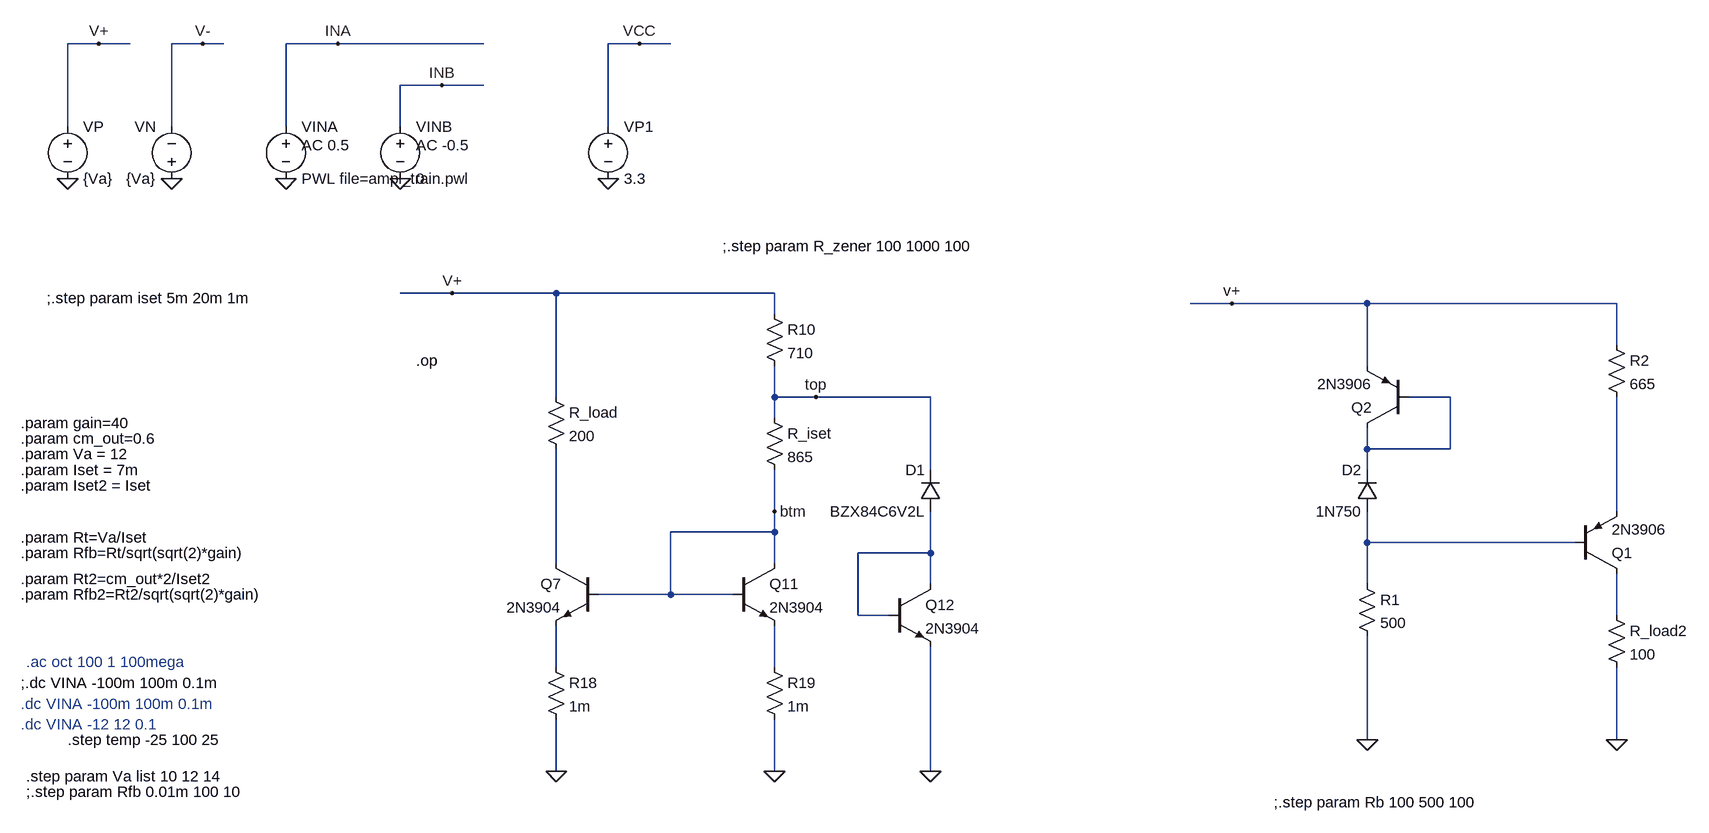
[diagram p0: schematic current_source_learning1.asc]
current_source_learning1.asc, the LTspice schematic file:
Version 4.1
SHEET 1 4868 1780
WIRE -16 -768 -64 -768
WIRE 32 -768 -16 -768
WIRE 144 -768 96 -768
WIRE 176 -768 144 -768
WIRE 352 -768 272 -768
WIRE 576 -768 352 -768
WIRE 816 -768 768 -768
WIRE 864 -768 816 -768
WIRE 512 -704 448 -704
WIRE 576 -704 512 -704
WIRE -64 -640 -64 -768
WIRE 96 -640 96 -768
WIRE 272 -640 272 -768
WIRE 448 -640 448 -704
WIRE 768 -640 768 -768
WIRE 528 -384 448 -384
WIRE 688 -384 528 -384
WIRE 1024 -384 688 -384
WIRE 1728 -368 1664 -368
WIRE 1936 -368 1728 -368
WIRE 2320 -368 1936 -368
WIRE 1024 -352 1024 -384
WIRE 2320 -304 2320 -368
WIRE 1936 -272 1936 -368
WIRE 688 -224 688 -384
WIRE 1024 -224 1024 -272
WIRE 1088 -224 1024 -224
WIRE 1264 -224 1088 -224
WIRE 2064 -224 2000 -224
WIRE 1024 -192 1024 -224
WIRE 1936 -144 1936 -176
WIRE 2064 -144 2064 -224
WIRE 2064 -144 1936 -144
WIRE 1264 -112 1264 -224
WIRE 1936 -112 1936 -144
WIRE 1024 -48 1024 -112
WIRE 2320 -48 2320 -224
WIRE 1024 -16 1024 -48
WIRE 1024 -16 864 -16
WIRE 1936 0 1936 -48
WIRE 2256 0 1936 0
WIRE 1264 16 1264 -48
WIRE 1264 16 1152 16
WIRE 688 32 688 -144
WIRE 1024 32 1024 -16
WIRE 1264 64 1264 16
WIRE 1936 64 1936 0
WIRE 864 80 864 -16
WIRE 864 80 752 80
WIRE 960 80 864 80
WIRE 1152 112 1152 16
WIRE 1200 112 1152 112
WIRE 2320 112 2320 48
WIRE 688 192 688 128
WIRE 1024 192 1024 128
WIRE 1936 304 1936 144
WIRE 2320 304 2320 192
WIRE 688 352 688 272
WIRE 1024 352 1024 272
WIRE 1264 352 1264 160
FLAG -64 -560 0
FLAG 272 -560 0
FLAG 96 -560 0
FLAG 448 -560 0
FLAG -16 -768 V+
FLAG 144 -768 V-
FLAG 352 -768 INA
FLAG 512 -704 INB
FLAG 768 -560 0
FLAG 816 -768 VCC
FLAG 688 352 0
FLAG 1024 352 0
FLAG 528 -384 V+
FLAG 1264 352 0
FLAG 1088 -224 top
FLAG 1024 -48 btm
FLAG 1936 304 0
FLAG 1728 -368 v+
FLAG 2320 304 0
SYMBOL voltage -64 -656 R0
SYMATTR InstName VP
SYMATTR Value {Va}
SYMBOL voltage 96 -544 R180
WINDOW 0 24 96 Left 2
WINDOW 3 24 16 Left 2
SYMATTR InstName VN
SYMATTR Value {Va}
SYMBOL voltage 272 -656 R0
WINDOW 123 24 44 Left 2
WINDOW 39 0 0 Left 0
SYMATTR Value2 AC 0.5
SYMATTR InstName VINA
SYMATTR Value PWL file=ampl_train.pwl
SYMBOL voltage 448 -656 R0
WINDOW 123 24 44 Left 2
WINDOW 39 0 0 Left 0
SYMATTR Value2 AC -0.5
SYMATTR InstName VINB
SYMATTR Value 0
SYMBOL voltage 768 -656 R0
SYMATTR InstName VP1
SYMATTR Value 3.3
SYMBOL npn 752 32 M0
SYMATTR InstName Q7
SYMATTR Value 2N3904
SYMBOL npn 960 32 R0
SYMATTR InstName Q11
SYMATTR Value 2N3904
SYMBOL res 1008 -368 R0
SYMATTR InstName R10
SYMATTR Value 710
SYMBOL res 1008 -208 R0
SYMATTR InstName R_iset
SYMATTR Value 865
SYMBOL res 672 -240 R0
SYMATTR InstName R_load
SYMATTR Value 200
SYMBOL res 672 176 R0
SYMATTR InstName R18
SYMATTR Value 1m
SYMBOL res 1008 176 R0
SYMATTR InstName R19
SYMATTR Value 1m
SYMBOL diode 1280 -48 R180
WINDOW 0 24 64 Left 2
WINDOW 3 24 0 Left 2
SYMATTR InstName D1
SYMATTR Value BZX84C6V2L
SYMATTR Description Diode
SYMATTR Type diode
SYMBOL npn 1200 64 R0
SYMATTR InstName Q12
SYMATTR Value 2N3904
SYMBOL pnp 2256 48 M180
SYMATTR InstName Q1
SYMATTR Value 2N3906
SYMBOL pnp 2000 -176 R180
SYMATTR InstName Q2
SYMATTR Value 2N3906
SYMBOL diode 1952 -48 R180
WINDOW 0 24 64 Left 2
WINDOW 3 24 0 Left 2
SYMATTR InstName D2
SYMATTR Value 1N750
SYMATTR Description Diode
SYMATTR Type diode
SYMBOL res 1920 48 R0
SYMATTR InstName R1
SYMATTR Value 500
SYMBOL res 2304 -320 R0
SYMATTR InstName R2
SYMATTR Value 665
SYMBOL res 2304 96 R0
SYMATTR InstName R_load2
SYMATTR Value 100
TEXT -136 216 Left 2 !;.dc VINA -100m 100m 0.1m
TEXT -136 248 Left 2 ;.dc VINA -100m 100m 0.1m
TEXT -64 304 Left 2 !.step temp -25 100 25
TEXT -128 384 Left 2 !;.step param Rfb 0.01m 100 10
TEXT -136 280 Left 2 ;.dc VINA -12 12 0.1
TEXT -128 184 Left 2 ;.ac oct 100 1 100mega
TEXT -136 16 Left 2 !.param Rfb=Rt/sqrt(sqrt(2)*gain)
TEXT -136 -8 Left 2 !.param Rt=Va/Iset
TEXT -136 -112 Left 2 !.param Iset = 7m
TEXT -136 -136 Left 2 !.param Va = 12
TEXT -136 56 Left 2 !.param Rt2=cm_out*2/Iset2
TEXT -128 360 Left 2 !.step param Va list 10 12 14
TEXT -136 -184 Left 2 !.param gain=40
TEXT -136 80 Left 2 !.param Rfb2=Rt2/sqrt(sqrt(2)*gain)
TEXT -136 -160 Left 2 !.param cm_out=0.6
TEXT -136 -88 Left 2 !.param Iset2 = Iset
TEXT -96 -376 Left 2 !;.step param iset 5m 20m 1m
TEXT 472 -280 Left 2 !.op
TEXT 944 -456 Left 2 !;.step param R_zener 100 1000 100
TEXT 1792 400 Left 2 !;.step param Rb 100 500 100

The netlist it stands for:
* current_source_learning1.asc
VP V+ 0 {Va}
VN 0 V- {Va}
VINA INA 0 PWL file=ampl_train.pwl AC 0.5
VINB INB 0 0 AC -0.5
VP1 VCC 0 3.3
Q7 N005 btm N007 0 2N3904
Q11 btm btm N008 0 2N3904
R10 V+ top 710
R_iset top btm 865
R_load V+ N005 200
R18 N007 0 1m
R19 N008 0 1m
D1 N004 top BZX84C6V2L
Q12 N004 N004 0 0 2N3904
Q1 N006 N003 N002 0 2N3906
Q2 N001 N001 V+ 0 2N3906
D2 N003 N001 1N750
R1 N003 0 500
R2 V+ N002 665
R_load2 N006 0 100
.model D D
.lib standard.dio
.model NPN NPN
.model PNP PNP
.lib standard.bjt
;.dc VINA -100m 100m 0.1m
* .dc VINA -100m 100m 0.1m
.step temp -25 100 25
;.step param Rfb 0.01m 100 10
* .dc VINA -12 12 0.1
* .ac oct 100 1 100mega
.param Rfb=Rt/sqrt(sqrt(2)*gain)
.param Rt=Va/Iset
.param Iset = 7m
.param Va = 12
.param Rt2=cm_out*2/Iset2
.step param Va list 10 12 14
.param gain=40
.param Rfb2=Rt2/sqrt(sqrt(2)*gain)
.param cm_out=0.6
.param Iset2 = Iset
;.step param iset 5m 20m 1m
.op
;.step param R_zener 100 1000 100
;.step param Rb 100 500 100
.backanno
.end